# EAGLE design Shapeoko_Controller (EAGLE 6.6.0)
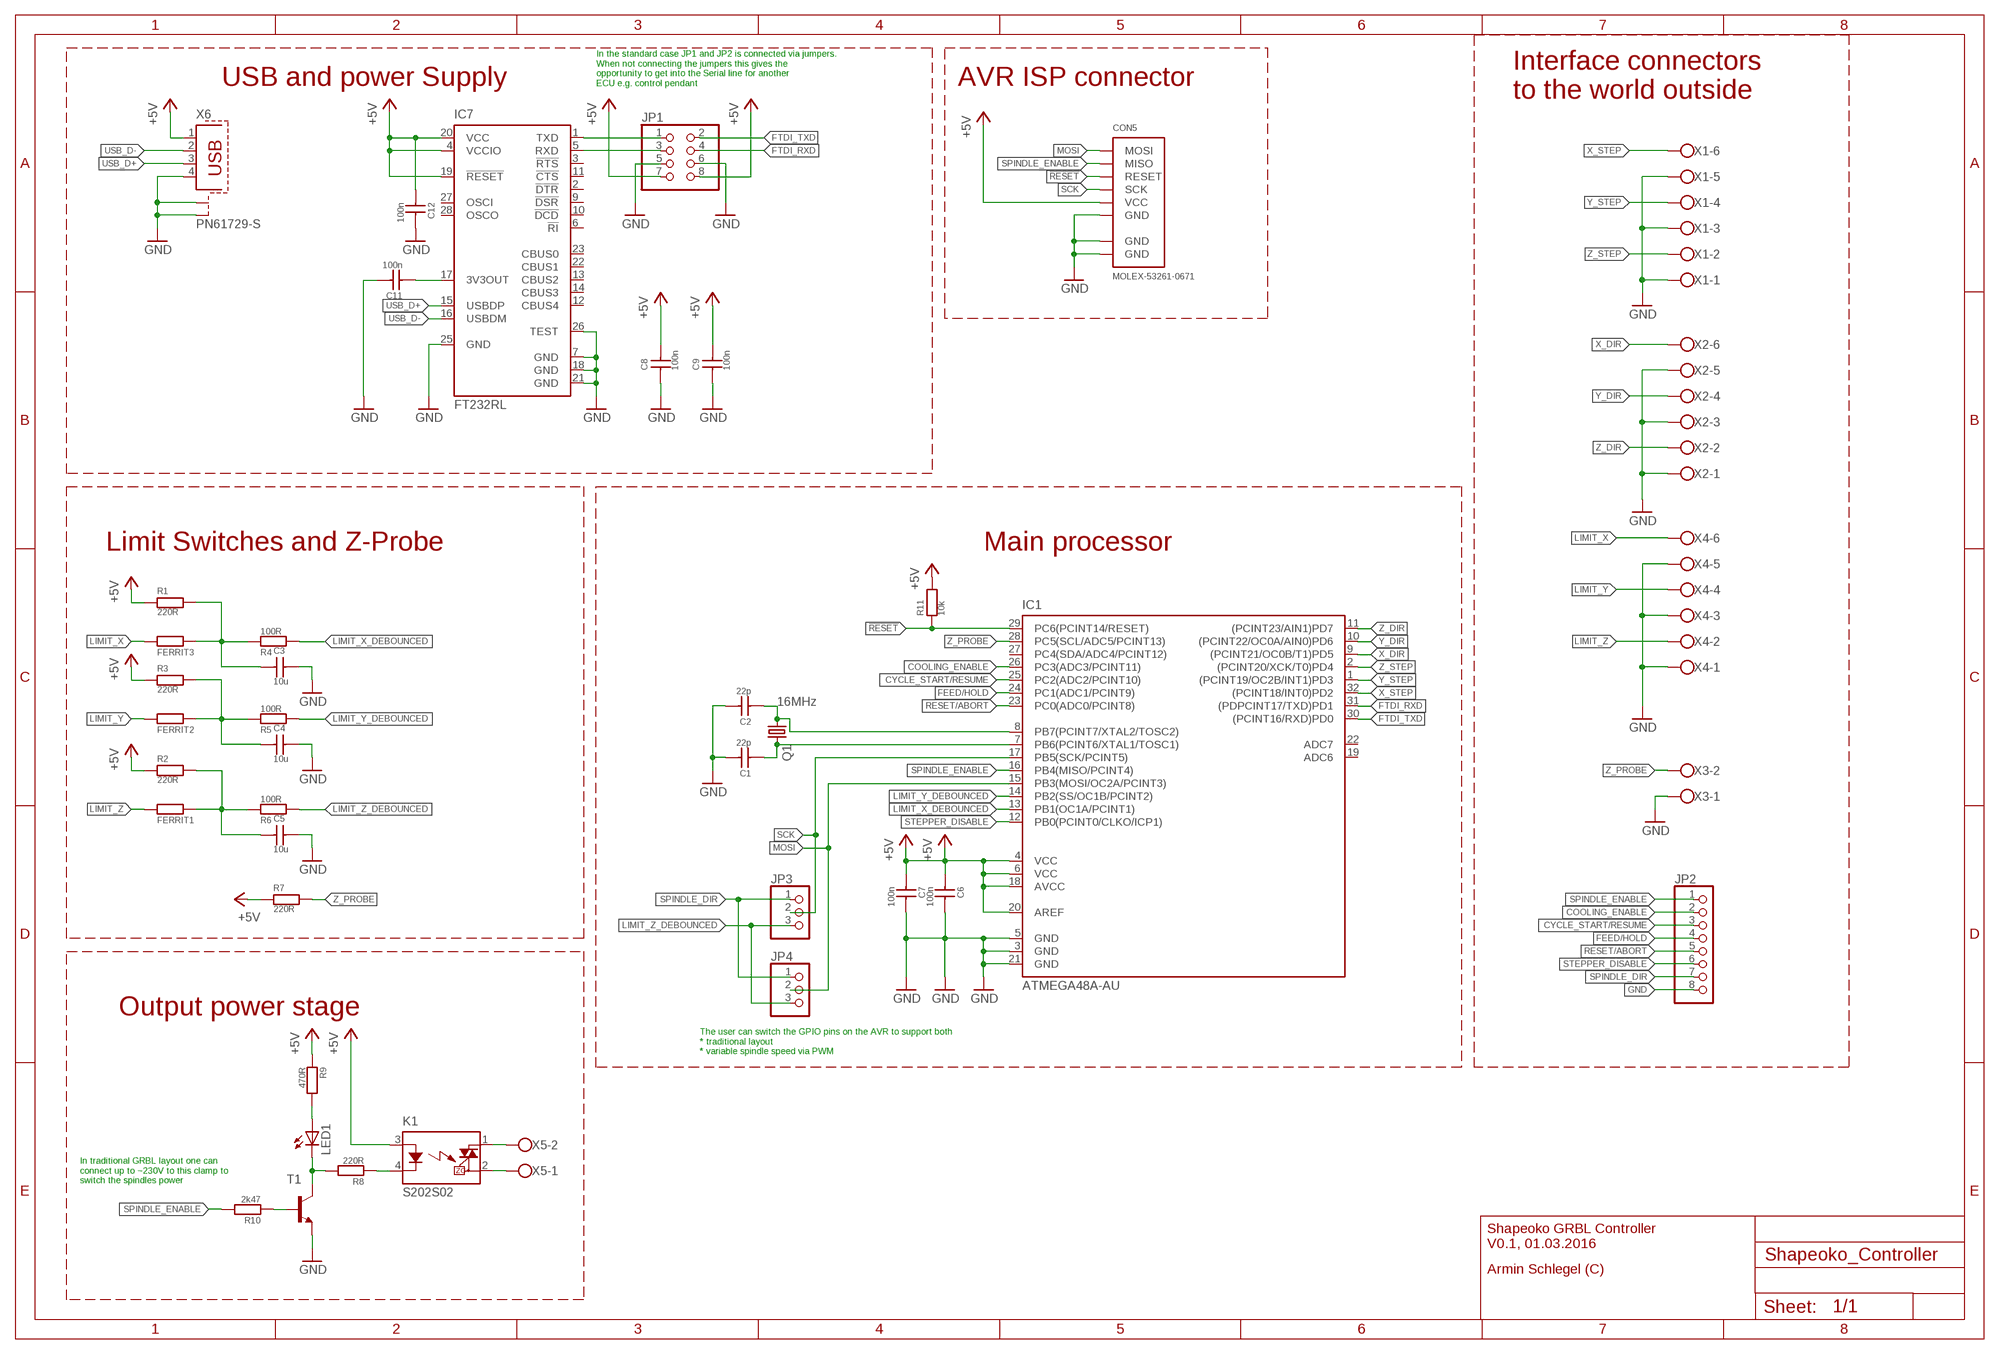
[diagram p0: schematic, sheet 1]

## Parts
C1  22p  C_SMD0603  [C0603]
C2  22p  C_SMD0603  [C0603]
C3  10u  C_SMD0805  [C0805]
C4  10u  C_SMD0805  [C0805]
C5  10u  C_SMD0805  [C0805]
C6  100n  C_SMD0603  [C0603]
C7  100n  C_SMD0603  [C0603]
C8  100n  C_SMD0603  [C0603]
C9  100n  C_SMD0603  [C0603]
C11  100n  C_SMD0603  [C0603]
C12  100n  C_SMD0603  [C0603]
CON5  MOLEX-53261-0671  [MOLEX-53261-0671]
FERRIT1  R0805  [R0805]
FERRIT2  R0805  [R0805]
FERRIT3  R0805  [R0805]
IC1  ATMEGA48A-AU  [TQFP32]
IC7  FT232RL  [SSOP28]
JP1  PINHD-2X4  [2X04]
JP2  PINHD-1X8  [1X08]
JP3  PINHD-1X3  [1X03]
JP4  PINHD-1X3  [1X03]
K1  S202S02  [S202S02]
LED1  LED3MM  [LED3MM]
Q1  16MHz  CRYSTALHC49UP  [HC49UP]
R1  220R  R0603  [R0603]
R2  220R  R0603  [R0603]
R3  220R  R0603  [R0603]
R4  100R  R0603  [R0603]
R5  100R  R0603  [R0603]
R6  100R  R0603  [R0603]
R7  220R  R0603  [R0603]
R8  220R  R0603  [R0603]
R9  470R  R0603  [R0603]
R10  2k47  R0603  [R0603]
R11  10k  R0603  [R0603]
T1  BC847-NPN-SOT23-BEC  [SOT23-BEC]
X1  W237-136  [W237-136]
X2  W237-136  [W237-136]
X3  W237-102  [W237-102]
X4  W237-136  [W237-136]
X5  W237-102  [W237-102]
X6  PN61729-S  [PN61729-S]

## Nets
!RESET: CON5.3(RESET) IC1.29(PC6(PCINT14/RESET)) R11.1
+5V: C6.1 C7.1 C8.2 C9.2 C12.1 CON5.5(VCC) IC1.4(VCC) IC1.6(VCC) IC1.18(AVCC) IC1.20(AREF) IC7.4(VCCIO) IC7.19(!RESET) IC7.20(VCC) JP1.7 JP1.8 K1.3(A) R1.1 R2.1 R3.1 R7.1 R9.1 R11.2 X6.1
COOLING_ENABLE: IC1.26(PC3(ADC3/PCINT11)) JP2.2
CYCLE_START/RESUME: IC1.25(PC2(ADC2/PCINT10)) JP2.3
FEED/HOLD: IC1.24(PC1(ADC1/PCINT9)) JP2.4
FTDI_3V3OUT: C11.1 IC7.17(3V3OUT)
FTDI_RXD: IC1.31((PDPCINT17/TXD)PD1) JP1.4
FTDI_TXD: IC1.30((PCINT16/RXD)PD0) JP1.2
GND: C1.2 C2.2 C3.2 C4.2 C5.2 C6.2 C7.2 C8.1 C9.1 C11.2 C12.2 CON5.6(GND) CON5.GND@1(GND) CON5.GND@2(GND) IC1.3(GND) IC1.5(GND) IC1.21(GND) IC7.7(GND) IC7.18(GND) IC7.21(GND) IC7.25(GND) IC7.26(TEST) JP1.5 JP1.6 JP2.8 T1.E X1.1 X1.3 X1.5 X2.1 X2.3 X2.5 X3.1 X4.1 X4.3 X4.5 X6.4 X6.S1 X6.S2
LIMIT_INT_X: C3.1 FERRIT3.2 R1.2 R4.1
LIMIT_INT_Y: C4.1 FERRIT2.2 R3.2 R5.1
LIMIT_INT_Z: C5.1 FERRIT1.2 R2.2 R6.1
LIMIT_X: FERRIT3.1 X4.6
LIMIT_X_DEBOUNCED: IC1.13(PB1(OC1A/PCINT1)) R4.2
LIMIT_Y: FERRIT2.1 X4.4
LIMIT_Y_DEBOUNCED: IC1.14(PB2(SS/OC1B/PCINT2)) R5.2
LIMIT_Z: FERRIT1.1 X4.2
LIMIT_Z_DEBOUNCED: JP3.3 JP4.3 R6.2
MOSI: CON5.1(MOSI) IC1.15(PB3(MOSI/OC2A/PCINT3)) JP4.2
N$1: C2.1 IC1.8(PB7(PCINT7/XTAL2/TOSC2)) Q1.1
N$2: C1.1 IC1.7(PB6(PCINT6/XTAL1/TOSC1)) Q1.2
N$3: LED1.K(C) R8.2 T1.C
N$4: LED1.A R9.2
N$5: IC7.1(TXD) JP1.1
N$6: R10.1 T1.B
N$7: K1.4(K) R8.1
N$8: IC7.5(RXD) JP1.3
RESET/ABORT: IC1.23(PC0(ADC0/PCINT8)) JP2.5
SCK: CON5.4(SCK) IC1.17(PB5(SCK/PCINT5)) JP3.2
SPINDLE_DIR: JP2.7 JP3.1 JP4.1
SPINDLE_ENABLE: CON5.2(MISO) IC1.16(PB4(MISO/PCINT4)) JP2.1 R10.2
SPINDLE_N: K1.2(DS2) X5.1
SPINDLE_P: K1.1(DS1) X5.2
STEPPER_DISABLE: IC1.12(PB0(PCINT0/CLKO/ICP1)) JP2.6
USB_D+: IC7.15(USBDP) X6.3
USB_D-: IC7.16(USBDM) X6.2
X_DIR: IC1.9((PCINT21/OC0B/T1)PD5) X2.6
X_STEP: IC1.32((PCINT18/INT0)PD2) X1.6
Y_DIR: IC1.10((PCINT22/OC0A/AIN0)PD6) X2.4
Y_STEP: IC1.1((PCINT19/OC2B/INT1)PD3) X1.4
Z_DIR: IC1.11((PCINT23/AIN1)PD7) X2.2
Z_PROBE: IC1.28(PC5(SCL/ADC5/PCINT13)) R7.2 X3.2
Z_STEP: IC1.2((PCINT20/XCK/T0)PD4) X1.2
Unconnected: IC1.19(ADC6) IC1.22(ADC7) IC1.27(PC4(SDA/ADC4/PCINT12)) IC7.2(!DTR) IC7.3(!RTS) IC7.6(!RI) IC7.9(!DSR) IC7.10(!DCD) IC7.11(!CTS) IC7.12(CBUS4) IC7.13(CBUS2) IC7.14(CBUS3) IC7.22(CBUS1) IC7.23(CBUS0) IC7.27(OSCI) IC7.28(OSCO)

## Notes on the sheet
- USB and power Supply
- In the standard case JP1 and JP2 is connected via jumpers.
  When not connecting the jumpers this gives the 
  opportunity to get into the Serial line for another 
  ECU e.g. control pendant
- AVR ISP connector
- Interface connectors
  to the world outside
- Limit Switches and Z-Probe | Main processor
- Output power stage
- The user can switch the GPIO pins on the AVR to support both 
  * traditional layout 
  * variable spindle speed via PWM
- In traditional GRBL layout one can
  connect up to ~230V to this clamp to
  switch the spindles power
- Shapeoko GRBL Controller
  V0.1, 01.03.2016
- Armin Schlegel (C)

## Library data of the parts
C1-C9 C11 C12 = SchlegelAr_Master:C_SMD: C SMD 0402, 0603, 0805, 1206 last modified: Armin Schlegel, 24.03.2014
CON5 = SchlegelAr_Master:MOLEX-53261-0671: MOLEX-53261-0671 - Molex picoblade 53261-0671 6 pol last modified: Armin Schlegel, 28.04.2014 http://de.mouser.com/ProductDetail/Molex/53261-0671/?qs=%2Fha2pyFadujL8XqTNrjzA%2Fy0AZso5hx2IWE7X8dEAdsn1tpb%2FKahAA%3D%3D http://www.mouser.com/ds/2/276/0532610671_PCB_HEADERS-170915.pdf
FERRIT1-FERRIT3 R1-R11 = SchlegelAr_Master:R: Widerstaende in 0402, 0603, 0805, 1206, 2512 last modified: Armin Schlegel, 28.04.2014
IC1 = SchlegelAr_Master:ATMEGA48A-AU: ATMEGA48A-AU last modified: Armin Schlegel, 22.03.2014 http://de.mouser.com/ProductDetail/Atmel/ATMEGA48A-AU/?qs=sGAEpiMZZMvqv2n3s2xjse40PngS4U1xmCDanmh3raU%3D http://www.mouser.com/ds/2/36/doc8271-50296.pdf
IC7 = SchlegelAr_Master:FT232RL: FT232RL - USB-IC-Schnittstelle USB to Serial UART Enhanced IC last modified: Armin Schlegel, 28.04.2014 http://de.mouser.com/ProductDetail/FTDI/FT232RL-REEL/?qs=sGAEpiMZZMs5ceO8zL%252bTxyQLQIH6hE7q http://www.mouser.com/ds/2/163/DS_FT232R-11534.pdf
JP1 = pinhead:PINHD-2X4: PIN HEADER
JP2 = pinhead:PINHD-1X8: PIN HEADER
JP3 JP4 = pinhead:PINHD-1X3: PIN HEADER
K1 = relay:S*02S02: IT(rms) 8A, Zero Cross type SIP 4pin Triac output SSR Source: http://sharp-world.com/products/device/lineup/data/pdf/datasheet/s102s02_e.pdf; MPN: S202S02F; OC_FARNELL: 1618475; OC_NEWARK: 14N9588
LED1 = led:LED: LED OSRAM: - CHIPLED LG R971, LG N971, LY N971, LG Q971, LY Q971, LO R971, LY R971 LH N974, LH R974 LS Q976, LO Q976, LY Q976 LO Q996 - Hyper CHIPLED LW Q18S LB Q993, LB Q99A, LB R99A - SideLED LS A670, LO A670, LY A670, LG A670, LP A670 LB A673, LV A673, LT A673, LW A673 LH A674 LY A675 LS A676, LA A676, LO A676, LY A676, LW A676 LS A679, LY A679, LG A679 - Hyper Micro SIDELED® LS Y876, LA Y876, LO Y876, LY Y876 LT Y87S - SmartLED LW L88C, LW L88S LB L89C, LB L89S, LG L890 LS L89K, LO L89K, LY L89K LS L896, LA L896, LO L896, LY L896 - TOPLED LS T670, LO T670, LY T670, LG T670, LP T670 LSG T670, LSP T670, LSY T670, LOP T670, LYG T670 LG T671, LOG T671, LSG T671 LB T673, LV T673, LT T673, LW T673 LH T674 LS T676, LA T676, LO T676, LY T676, LB T676, LH T676, LSB T676, LW T676 LB T67C, LV T67C, LT T67C, LS T67K, LO T67K, LY T67K, LW E67C LS E67B, LA E67B, LO E67B, LY E67B, LB E67C, LV E67C, LT E67C LW T67C LS T679, LY T679, LG T679 LS T770, LO T770, LY T770, LG T770, LP T770 LB T773, LV T773, LT T773, LW T773 LH T774 LS E675, LA E675, LY E675, LS T675 LS T776, LA T776, LO T776, LY T776, LB T776 LHGB T686 LT T68C, LB T68C - Hyper Mini TOPLED® LB M676 - Mini TOPLED Santana® LG M470 LS M47K, LO M47K, LY M47K Source: http://www.osram.convergy.de LUXEON: - LUMILED® LXK2-PW12-R00, LXK2-PW12-S00, LXK2-PW14-U00, LXK2-PW14-V00 LXK2-PM12-R00, LXK2-PM12-S00, LXK2-PM14-U00 LXK2-PE12-Q00, LXK2-PE12-R00, LXK2-PE12-S00, LXK2-PE14-T00, LXK2-PE14-U00 LXK2-PB12-K00, LXK2-PB12-L00, LXK2-PB12-M00, LXK2-PB14-N00, LXK2-PB14-P00, LXK2-PB14-Q00 LXK2-PR12-L00, LXK2-PR12-M00, LXK2-PR14-Q00, LXK2-PR14-R00 LXK2-PD12-Q00, LXK2-PD12-R00, LXK2-PD12-S00 LXK2-PH12-R00, LXK2-PH12-S00 LXK2-PL12-P00, LXK2-PL12-Q00, LXK2-PL12-R00 Source: www.luxeon.com KINGBRIGHT: KA-3528ASYC Source: www.kingbright.com
Q1 = crystal:CRYSTAL: CRYSTAL; OC_FARNELL: unknown; OC_NEWARK: unknown
T1 = transistor:*-NPN-: NPN Transistror BF959 corrected 2008.03.06
X1 X2 X4 = con-wago-500:W237-136: WAGO SCREW CLAMP; MPN: 237-136; OC_FARNELL: unknown; OC_NEWARK: 84K9151
X3 X5 = con-wago-500:W237-102: WAGO SCREW CLAMP; MPN: 237-102; OC_FARNELL: unknown; OC_NEWARK: 70K9898
X6 = con-berg:PN61729-S: BERG USB connector; OC_FARNELL: unknown; OC_NEWARK: unknown

## Board
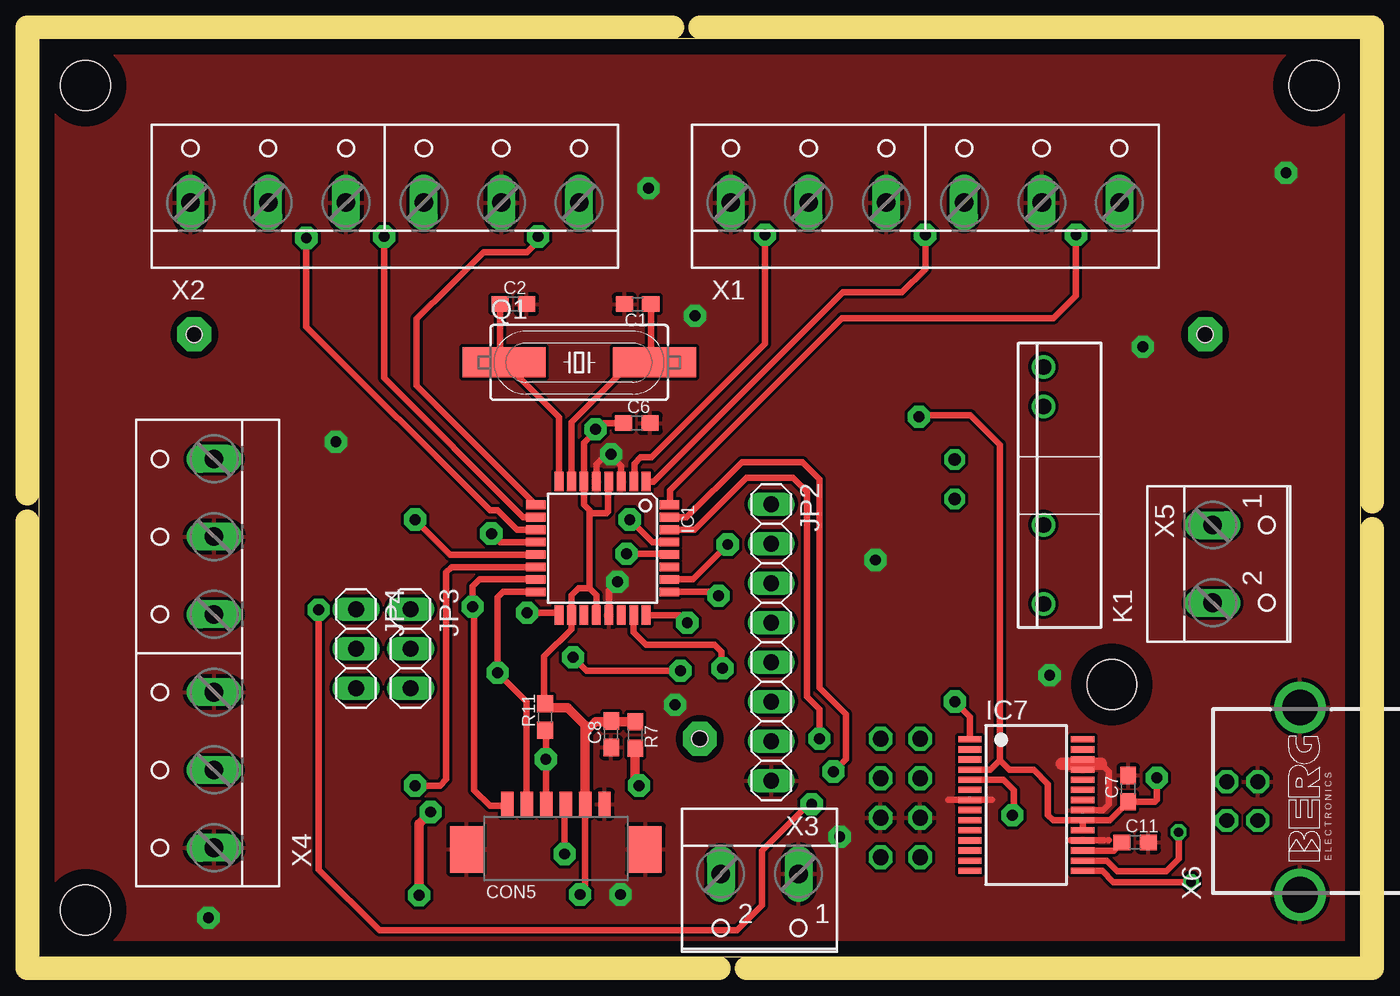
[diagram p1: board, top side]
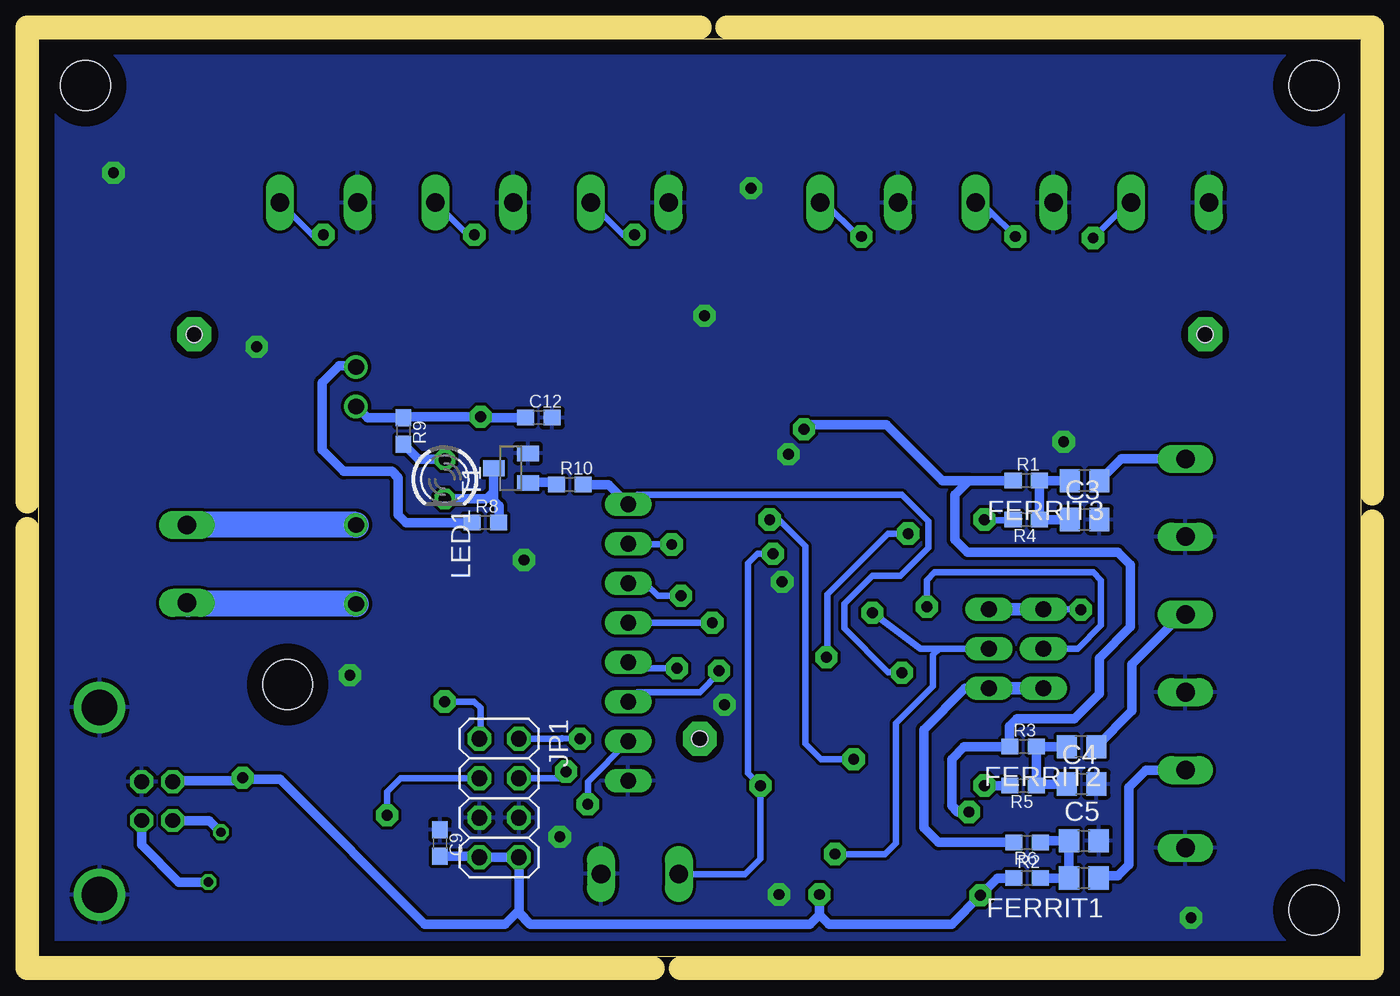
[diagram p2: board, bottom side, seen from below]

Size 85 x 59 mm. Coordinates in mm from the lower left corner, seen from the top.
Outline: 0,0 85,0 85,59 0,59 0,0
Copper layers (1*16): Top 0.035mm / dielectric 1.5mm / Bottom 0.035mm
Design rules "default *": minimum track width 10mil, minimum drill 24mil, track to track 8mil, track to pad 8mil, pad to pad 8mil, via to via 8mil, smd to smd 8mil, copper to edge 40mil, drill to drill 8mil, minimum pad ring 10mil, minimum via ring 8mil, stop-mask expansion 4mil, vias tented up to drill 0mil, thermal gap 10mil
Holes 3.2 mm at 3,56 3,3 82,56 69,17.5
Holes 1 mm at 10,40 75,40 42.5,14
Milling: 8 lines

### Footprints (pad centres in the part's own frame; a part is rotated, then mirrored left to right if it is on the bottom)
C0603 = smd 1.1 x 1: 1 -0.85,0; 2 0.85,0
C0805 = smd 1.3 x 1.5: 1 -0.95,0; 2 0.95,0
MOLEX-53261-0671 = smd 0.8 x 1.6: 1 -3.125,2.55; 2 -1.875,2.55; 3 -0.625,2.55; 4 0.625,2.55; 5 1.875,2.55; 6 3.125,2.55 | smd 2.1 x 3: GND@1 -5.75,-0.35; GND@2 5.75,-0.35
R0805 = smd 1.3 x 1.5: 1 -0.95,0; 2 0.95,0
TQFP32 = smd 1.27 x 0.559: 1 -4.293,2.8; 2 -4.293,2; 3 -4.293,1.2; 4 -4.293,0.4; 5 -4.293,-0.4; 6 -4.293,-1.2; 7 -4.293,-2; 8 -4.293,-2.8; 17 4.293,-2.8; 18 4.293,-2; 19 4.293,-1.2; 20 4.293,-0.4; 21 4.293,0.4; 22 4.293,1.2; 23 4.293,2; 24 4.293,2.8 | smd 0.559 x 1.27: 9 -2.8,-4.293; 10 -2,-4.293; 11 -1.2,-4.293; 12 -0.4,-4.293; 13 0.4,-4.293; 14 1.2,-4.293; 15 2,-4.293; 16 2.8,-4.293; 25 2.8,4.293; 26 2,4.293; 27 1.2,4.293; 28 0.4,4.293; 29 -0.4,4.293; 30 -1.2,4.293; 31 -2,4.293; 32 -2.8,4.293
SSOP28 = smd 0.4 x 1.5: 1 -4.225,-3.625; 2 -3.575,-3.625; 3 -2.925,-3.625; 4 -2.275,-3.625; 5 -1.625,-3.625; 6 -0.975,-3.625; 7 -0.325,-3.625; 8 0.325,-3.625; 9 0.975,-3.625; 10 1.625,-3.625; 11 2.275,-3.625; 12 2.925,-3.625; 13 3.575,-3.625; 14 4.225,-3.625; 15 4.225,3.625; 16 3.575,3.625; 17 2.925,3.625; 18 2.275,3.625; 19 1.625,3.625; 20 0.975,3.625; 21 0.325,3.625; 22 -0.325,3.625; 23 -0.975,3.625; 24 -1.625,3.625; 25 -2.275,3.625; 26 -2.925,3.625; 27 -3.575,3.625; 28 -4.225,3.625
2X04 = drill 1.016 octagon: 1 -3.81,-1.27; 2 -3.81,1.27; 3 -1.27,-1.27; 4 -1.27,1.27; 5 1.27,-1.27; 6 1.27,1.27; 7 3.81,-1.27; 8 3.81,1.27
1X08 = drill 1.016 long: 1 -8.89,0; 2 -6.35,0; 3 -3.81,0; 4 -1.27,0; 5 1.27,0; 6 3.81,0; 7 6.35,0; 8 8.89,0
1X03 = drill 1.016 long: 1 -2.54,0; 2 0,0; 3 2.54,0
S202S02 = drill 1: 1 -7.62,0; 2 -2.54,0; 3 5.08,0; 4 7.62,0
LED3MM = drill 0.813 octagon: A -1.27,0; K 1.27,0
HC49UP = smd 5.334 x 1.93: 1 -4.826,0; 2 4.826,0
R0603 = smd 1.1 x 1: 1 -0.85,0; 2 0.85,0
SOT23-BEC = smd 1 x 1.4: B -0.95,-1.1; C 0,1.1; E 0.95,-1.1
W237-136 = drill 1.194 long: 1 -12.5,-1.27; 2 -7.5,-1.27; 3 -2.5,-1.27; 4 2.5,-1.27; 5 7.5,-1.27; 6 12.5,-1.27
W237-102 = drill 1.194 long: 1 -2.5,-1.27; 2 2.5,-1.27
PN61729-S = drill 0.95 octagon: 1 1.25,4.71; 2 -1.25,4.71; 3 -1.25,2.71; 4 1.25,2.71 | drill 2.3 pad 2.9: S1 -6.02,0; S2 6.02,0

### Placement (x,y rotation side)
C1  38.5,41.95 180 top
C2  30.5,41.95 0 top
C3  17.75,28.1 0 bottom
C4  17.95,11.1 0 bottom
C5  17.8,7.45 0 bottom
C6  38.45,34.3 0 top
C7  70.05,10.8 90 top
C8  36.8,14.3 90 top
C9  59.2,7.3 270 bottom
C11  70.5,7.35 0 top
C12  52.85,34.65 0 bottom
CON5  33.25,7.25 0 top
FERRIT1  17.8,5.05 180 bottom
FERRIT2  17.95,13.5 180 bottom
FERRIT3  17.75,30.6 180 bottom
IC1  36.25,26.25 270 top
IC7  63.5,9.75 270 top
JP1  55.4,10.2 270 bottom
JP2  47.1,20.2 270 top
JP3  23.9,19.8 270 top
JP4  20.4,19.8 270 top
K1  64.6,30.3 90 top
LED1  58.9,30.7 270 bottom
Q1  34.75,38.2 0 top
R1  21.5,30.6 0 bottom
R2  21.45,5.05 0 bottom
R3  21.7,13.5 0 bottom
R4  21.5,28.1 180 bottom
R5  21.7,11 180 bottom
R6  21.45,7.35 180 bottom
R7  38.35,14.25 270 top
R8  56.3,27.9 0 bottom
R9  61.55,33.8 270 bottom
R10  50.85,30.35 0 bottom
R11  32.55,15.4 90 top
T1  54.65,31.4 90 bottom
X1  57,49.75 0 top
X2  22.25,49.75 0 top
X3  46.35,4.05 180 top
X4  10,19.5 90 top
X5  76.75,25.25 270 top
X6  81.1,10 90 top

### Tracks (layer width: path | path; a pad name or v marks a point on that pad's centre or on a via)
!RESET  (via drill 0.7 pad 1.42)
  Top 0.406: IC1.29 39.45,26.65 v38,28.1 | CON5.3 32.6,9.82 v32.6,12.7 32.6,14.5 R11.1
  Bottom 0.406: v38,28.1 37.4,28.1 35.7,26.4 35.7,13.7 34.7,12.7 v32.6,12.7
+5V  (via drill 0.7 pad 1.42)
  Top 0.406: IC1.20 35.85,23.25 35.4,23.7 | 35.4,23.7 34.7,23.7 34.25,23.25 IC1.18 34.25,21.05 32.5,19.3 32.5,16.3 32.6,16.2 | IC7.20 IC7.19 | IC7.20 65.22,8.78 64.9,9.1 64.9,11.1 63.98,12.03 62.4,12.03 61.8,12.62 | IC1.4 36.6,29.49 36.6,28.6 36.5,28.5 35.4,28.5 | 35.4,28.5 35.4,28.7 35.05,29.05 IC1.6 35.05,33.05 35.8,33.8 v35.8,33.9 36.2,34.3 C6.1 | 38.3,15.15 R7.1 | 71.9,11.05 v71.9,11.5 71.9,10.1 71.75,9.95 C7.1 68.88,8.78 IC7.20 | 35.4,28.5 35.4,23.7 | CON5.5 35.12,4.33 v34.8,4 | 61.8,12.62 61.8,32.9 59.9,34.8 56.7,34.8 v56.6,34.7 | IC7.4 61.2,12.03 61.8,12.62
  Top 0.61: v25.2,9.3 24.45,8.55 v24.45,3.95 | 35.12,14.43 35.8,15.1 36.75,15.1 C8.2 36.85,15.1 R7.1 | 35.12,14.43 CON5.5 | R11.2 32.6,16.2 32.8,16 34,16 35.12,14.88 35.12,14.43
  Bottom 0.61: 25.2,30.6 26.1,29.7 26.1,26.8 25.3,26 15.6,26 14.8,25.2 14.8,21.2 16.8,19.2 16.8,16.9 18.4,15.3 22.1,15.3 22.6,14.8 22.6,13.55 R3.1 25.5,13.5 26.3,12.7 26.3,9.7 25.9,9.3 v25.2,9.3 | 25.2,30.6 R1.1 | 25.2,30.6 26.9,30.6 30.5,34.2 35.5,34.2 v35.8,33.9 | R2.1 23.35,5.05 v24.45,3.95 26.3,2.1 34.2,2.1 34.8,2.7 | C12.1 56.55,34.65 v56.6,34.7 61.5,34.7 R9.1 63.87,34.65 K1.3 | 54.13,3 JP1.8 JP1.7 56.73,6.45 C9.2 | 54.13,3 54.13,2.83 53.4,2.1 35.4,2.1 34.8,2.7 | v34.8,4 34.8,2.7 | 54.13,3 55.03,2.1 60.2,2.1 69.5,11.4 71.8,11.4 v71.9,11.5 71.9,11.3 76.34,11.3 X6.1
COOLING_ENABLE  (via drill 0.7 pad 1.42)
  Top 0.406: IC1.26 42.05,24.25 v44.3,26.5
  Bottom 0.406: v44.3,26.5 47.05,26.5 JP2.2
CYCLE_START/RESUME  (via drill 0.7 pad 1.42)
  Top 0.406: IC1.25 43.15,23.45 43.4,23.2 v43.7,23.2
  Bottom 0.406: JP2.3 46.01,24.01 45.2,23.2 v43.7,23.2
FEED/HOLD  (via drill 0.7 pad 1.42)
  Top 0.406: IC1.24 41.21,21.96 v41.7,21.47
  Bottom 0.406: v41.7,21.47 JP2.4
FTDI_3V3OUT
  Top 0.406: IC7.17 69.12,6.83 C11.1
FTDI_RXD  (via drill 0.7 pad 1.42)
  Top 0.406: IC1.31 41.65,28.25 45.2,31.8 49.1,31.8 50.2,30.7 50.2,17.3 51.9,15.6 51.9,12.7 v51.1,11.9 51.5,12.3
  Bottom 0.406: v51.1,11.9 51.53,11.47 JP1.4
FTDI_TXD  (via drill 0.7 pad 1.42)
  Top 0.406: IC1.30 42.15,27.45 45.5,30.8 48.5,30.8 49.4,29.9 49.4,16.7 50.2,15.9 v50.2,14
  Bottom 0.406: v50.2,14 51.34,14.04 51.37,14.01 JP1.2
GND  (via drill 0.7 pad 1.42)
  Top 0.305: 67.1,12.3 67.1,12.1 67.2,12.1
  Top 0.406: 67.05,12.6 IC7.26 | IC7.21 68.42,9.43 68.8,9.8 68.8,11.9 68.3,12.4 | 68.78,7.47 68.8,7.5 | 66.33,7.47 IC7.18 68.47,7.47 68.5,7.5 | 61.3,10.1 58.5,10.1 | IC1.5 35.85,31.65 36.2,32 37,32 37.45,31.55 IC1.3 | IC1.21 36.65,23.55 v37.2,24.1
  Top 0.813: 68.3,12.4 67,12.4 | 65.8,12.4 67,12.4 | 67,12.4 67.1,12.3
  Bottom 0.61: T1.E 53.35,32.35
  other vias: 36.8,32.3 42.2,41.2 53.8,25.5 19.1,33.1 40.9,16.2 65,18.1 10.9,2.5 71,39.2 39.2,49.4 37.4,4 51.5,7.7 80.2,50.4
  pour Top: 0,59 85,59 85,0 0,0
  pour Bottom: 0.15,58.95 84.95,58.95 84.95,0 0.15,0
LIMIT_INT_X
  Bottom 0.61: FERRIT3.2 R1.2 R4.1 C3.1
LIMIT_INT_Y
  Bottom 0.61: C4.1 20.75,11.1 R5.1 R3.2 FERRIT2.2
LIMIT_INT_Z
  Bottom 0.61: R2.2 FERRIT1.2 C5.1 20.5,7.45 R6.1
LIMIT_X
  Bottom 0.61: X4.6 15.4,32 FERRIT3.1
LIMIT_X_DEBOUNCED  (via drill 0.7 pad 1.42)
  Top 0.406: IC1.13 26.45,25.85 v24.2,28.1
  Bottom 0.406: R4.2 22.3,28.05 24.15,28.05 v24.2,28.1
LIMIT_Y
  Bottom 0.61: FERRIT2.1 14.7,15.8 14.7,18.8 11.5,22 X4.4
LIMIT_Y_DEBOUNCED  (via drill 0.7 pad 1.42)
  Top 0.406: IC1.14 26.55,25.05 26.2,24.7 26.2,11.4 25.8,11 v24.2,11
  Bottom 0.61: R5.2 v24.2,11
LIMIT_Z
  Bottom 0.61: FERRIT1.1 16.7,5.2 15.6,5.2 14.9,5.9 14.9,10.9 13.8,12 X4.2
LIMIT_Z_DEBOUNCED
  Bottom 0.61: R6.2 27.15,7.35 28.1,8.3 28.1,14.6 25.44,17.26 JP3.3
  Bottom 0.813: JP4.3 JP3.3
MOSI  (via drill 0.7 pad 1.42)
  Top 0.406: IC1.15 28.35,24.25 27.9,23.8 v27.9,22.5 28,22.4 28,10.7 29,9.7 30.02,9.7 CON5.1
  Bottom 0.406: JP4.2 18.2,19.8 16.7,21.3 16.7,24.2 17.2,24.7 27.4,24.7 27.9,24.2 v27.9,22.5
N$1
  Top 0.406: C2.1 29.65,38.47 Q1.1 33.45,34.67 IC1.8
N$2
  Top 0.406: C1.1 39.35,38.43 Q1.2 39.28,37.9 37.8,37.9 34.25,34.35 IC1.7
N$3
  Bottom 0.61: T1.C 55.75,29.9 | 55.75,29.9 55.75,29.35 55.4,29 55.4,27.95 R8.2 | LED1.K 56.22,29.43 55.75,29.9
N$4
  Bottom 0.61: LED1.A 60.57,31.97 R9.2
N$5  (via drill 0.7 pad 1.42)
  Top 0.406: IC7.1 59.88,15.43 v58.9,16.4
  Bottom 0.406: v58.9,16.4 57,16.4 56.6,16 56.6,14.12 56.67,14.05 JP1.1
N$6
  Bottom 0.61: T1.B 53.5,30.5 51.85,30.5 R10.1
N$7
  Bottom 0.61: R8.1 61.4,27.9 61.9,28.4 61.9,30.8 62.3,31.2 65.4,31.2 66.8,32.6 66.8,36.9 65.7,38 64.68,38 K1.4
N$8  (via drill 0.7 pad 1.42)
  Top 0.406: IC7.5 62.02,11.38 62.7,10.7 62.7,9.2 v62.6,9.1
  Bottom 0.406: JP1.3 61.73,11.47 62.6,10.6 v62.6,9.1
N$9
  pour Top: 9,57.5 70.5,57.5 70.5,54 9,54
N$10
  pour Top: 2,52 6.5,52 6.5,45.5 2,45.5 2,46.5
N$11
  pour Top: 72.5,53 72.5,45 77.5,45 77.5,55.5 73.5,55.5
N$12
  pour Top: 4.5,39 4.5,35 15,35 15,39
N$13
  pour Top: 1.5,33 6,33 6,6 1.5,6 1.5,32.5
N$14
  pour Top: 69,34.5 68.5,34.5 68.5,34 68.5,30 83.5,30 83.5,35 69,35
N$15
  pour Top: 52,4.5 52,1 69,1 69,3 68,4 65,4 65,4.5
N$16
  pour Bottom: 3,45.5 84.5,45.5 84.3,31 67.8,31 68,40.5 62,40.5 62,36 37.9,36 37.9,35.3 34.5,35.3 34.5,35.9 3,36
N$17
  pour Bottom: 52.5,22.5 59.5,22.5 59.5,18.5 52,18.5 52,22.5
  pour Bottom: 40.6,12.4 44.2,12.5 44.1,7.8 40.6,7.1 40.1,10.3
N$18
  pour Top: 52,22.5 59.5,22.5 59.5,18.5 52,18.5
N$19  (via drill 0.7 pad 2.18)
  other vias: 42.5,14
N$20  (via drill 0.7 pad 2.18)
  other vias: 75,40
N$21  (via drill 0.7 pad 2.18)
  other vias: 10,40
N$22
  pour Top: 41.5,12.5 44,12.5 46,10 45.5,9.5 43,9.5 41,11.5 41,12
N$23
  pour Top: 77,41.5 77,38.5 77.5,38 82,38 83,39 83,41.5 82.5,42 77.5,42
N$24
  pour Top: 2,42.5 6.5,42.5 8.5,40.5 6,38 3,38 2,39
RESET/ABORT  (via drill 0.7 pad 1.42)
  Top 0.406: IC1.23 38.25,20.85 39.05,20.05 43.45,20.05 43.9,19.6 43.9,18.6 v43.97,18.53
  Bottom 0.406: v43.97,18.53 46.7,18.53 JP2.5
SCK  (via drill 0.7 pad 1.42)
  Top 0.406: v31.4,22.1 33.31,22.1 IC1.17 | v33.8,6.6 33.8,9.72 CON5.4
  Bottom 0.406: JP3.2 27.1,19.8 | 27.1,19.8 28.3,19.8 v31.4,22.1 | 27.1,19.8 27.5,19.4 27.5,17.4 29.9,15 29.9,7.3 30.6,6.6 v33.8,6.6
SPINDLE_DIR  (via drill 0.7 pad 1.42)
  Top 0.406: v18,22.3 18,5.6 21.9,1.7 44.9,1.7 46.5,3.3 46.5,6.8 49.5,9.8 v49.7,9.8
  Bottom 0.406: JP4.1 18.04,22.34 v18,22.3 | v49.7,9.8 49.7,11.25 JP2.7
  Bottom 0.813: JP4.1 JP3.1
SPINDLE_ENABLE  (via drill 0.7 pad 1.42)
  Top 0.406: CON5.2 31.38,16.38 v29.5,18.25 29.5,23.1 29.85,23.45 IC1.16
  Bottom 0.406: v29.5,18.25 29.55,18.3 30.4,18.3 33.2,21.1 33.2,22.7 31.4,24.5 29.6,24.5 27.8,26.3 27.8,28 29.5,29.7 46.49,29.7 JP2.1
  Bottom 0.61: R10.2 48.36,30.35 JP2.1
SPINDLE_N
  Bottom 1.676: K1.2 X5.1
SPINDLE_P
  Bottom 1.676: K1.1 75.41,22.68 X5.2
STEPPER_DISABLE  (via drill 0.7 pad 1.42)
  Top 0.406: IC1.12 29.65,26.65 v29.1,27.2 | v41.26,18.39 35.21,18.39 v34.35,19.25
  Bottom 0.406: v29.1,27.2 30.4,27.2 34.3,23.3 34.3,19.3 v34.35,19.25 | v41.26,18.39 41.26,18.24 42.5,17 46.49,17 JP2.6
USB_D+  (via drill 0.6)
  Top 0.406: IC7.15 68.38,5.53 69.1,4.8 v74.1,4.8
  Bottom 0.61: v74.1,4.8 76,4.8 78.4,7.2 X6.3
USB_D-  (via drill 0.6)
  Top 0.406: IC7.16 68.67,6.17 69.35,5.5 72.5,5.5 73.3,6.3 v73.3,8
  Bottom 0.61: X6.2 74.05,8.75 v73.3,8
X_DIR  (via drill 0.7 pad 1.42)
  Top 0.406: v32.1,46.3 32.1,46 31.4,45.3 28.6,45.3 26.75,43.45 26.4,43.1 24.3,41 24.3,36.7 IC1.9
  Bottom 0.406: X2.6 34.48,48.48 32.3,46.3 v32.1,46.3
X_STEP  (via drill 0.7 pad 1.42)
  Top 0.406: IC1.32 40.6,29.11 40.6,30 51.65,41.05 65.25,41.05 66.7,42.5 v66.7,46.4
  Bottom 0.406: X1.6 67.42,46.4 v66.7,46.4
Y_DIR  (via drill 0.7 pad 1.42)
  Top 0.406: IC1.10 31.15,28.25 22.2,37.2 v22.2,46.3
  Bottom 0.406: 23.9,47.63 24.23,47.97 | 24.23,47.97 X2.4 | v22.2,46.3 23.86,47.97 24.23,47.97
Y_STEP  (via drill 0.7 pad 1.42)
  Top 0.406: v57,46.4 57,44.2 55.5,42.7 51.7,42.7 39.54,30.54 IC1.1
  Bottom 0.406: X1.4 57.42,46.4 v57,46.4
Z_DIR  (via drill 0.7 pad 1.42)
  Top 0.406: IC1.11 30.75,27.45 29.5,28.7 29,28.7 17.2,40.5 17.2,41.1 17.2,41.9 v17.2,46.2
  Bottom 0.406: X2.2 14.75,47.95 15.45,47.95 v17.2,46.2
Z_PROBE  (via drill 0.7 pad 1.42)
  Top 0.406: IC1.28 40.49,25.9 v37.8,25.9
  Top 0.61: v38.6,11 38.35,11.25 R7.2
  Bottom 0.406: X3.2 43.83,5.3 39.6,5.3 38.6,6.3 v38.6,11 39.4,11.8 39.4,25.3 38.8,25.9 v37.8,25.9
Z_STEP  (via drill 0.7 pad 1.42)
  Top 0.406: 38.2,30.59 IC1.2 38.3,30.59 38.3,31.7 38.7,32.1 39.4,32.1 46.7,39.4 v46.7,46.4
  Bottom 0.406: X1.2 47.42,46.4 v46.7,46.4

### Text on the board
tRestrict: Z | Y | X | Z | Y | X | Dir | Step | -> | <- | Limit | Spindle | X | top | Y | <- | Z | Z-Probe
bRestrict: <- | Shapeoko GRBL Controller Board V1 | -> | Armin Schlegel (19.02.2016) | bot | ->